# Altium schematic sheet TTP223.SchDoc
size A4; SheetNumber: 2; SheetTotal: 3
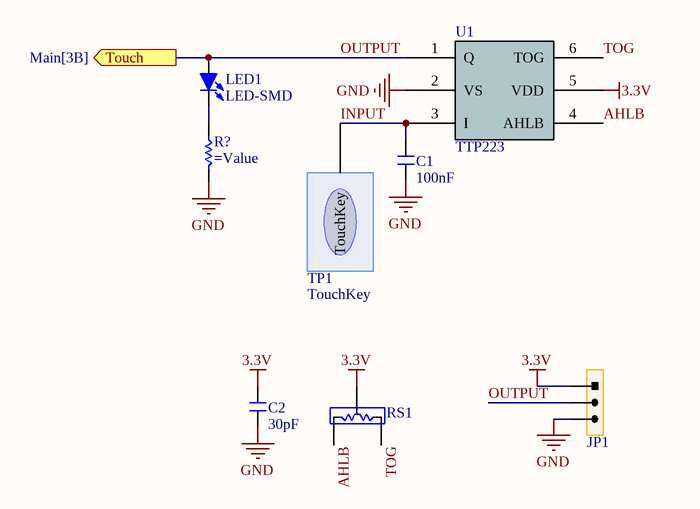
[diagram p0: TTP223.SchDoc]

## Parts
C1  100nF  [C 0805]
C2  30pF  [C 0805]
JP1  HDR-1X3  [HDR-1X3_M]  (value not drawn)
LED1  LED-SMD  [LED 0805G]
R?  (no value)  [R 0805]
RS1  Resistor Selector  [RS 0603]  (value not drawn)
TP1  TouchKey  [Square TouchKey (1.5cm)]
U1  TTP223  [SOT23-6L]

## Ports
Touch (out, see Main[3B])

## Nets
3.3V: C2.1 JP1.1 RS1.3 U1.5(VDD)
GND: C1.2 C2.2 JP1.3 R?.2 U1.2(VS)
AHLB: RS1.2 U1.4(AHLB)
INPUT: C1.1 TP1.1(TouchKey) U1.3(I)
OUTPUT: JP1.2 LED1.1(A) U1.1(Q) ; port Touch
TOG: RS1.1 U1.6(TOG)
NetLED1_2: LED1.2(K) R?.1

## Library data of the parts
C1 C2 = C: Non-polar patch capacitor; BOM名称: 无极性贴片电容; 版权归属: 源创客; 学习资源: www.ooocke.com
JP1 = Header 3: 3P Connector; BOM名称: 3P接插件; 版权归属: 源创客; 学习资源: www.ooocke.com
LED1 = LED-SMD: Patch LED; BOM名称: 贴片LED; 版权归属: 源创客; 学习资源: www.ooocke.com
R? = R: Chip resistor; 版权归属: 源创客; BOM名称: Chip resistor; 学习资源: www.ooocke.com